# Altium schematic sheet MedusaTester.SchDoc
size Letter
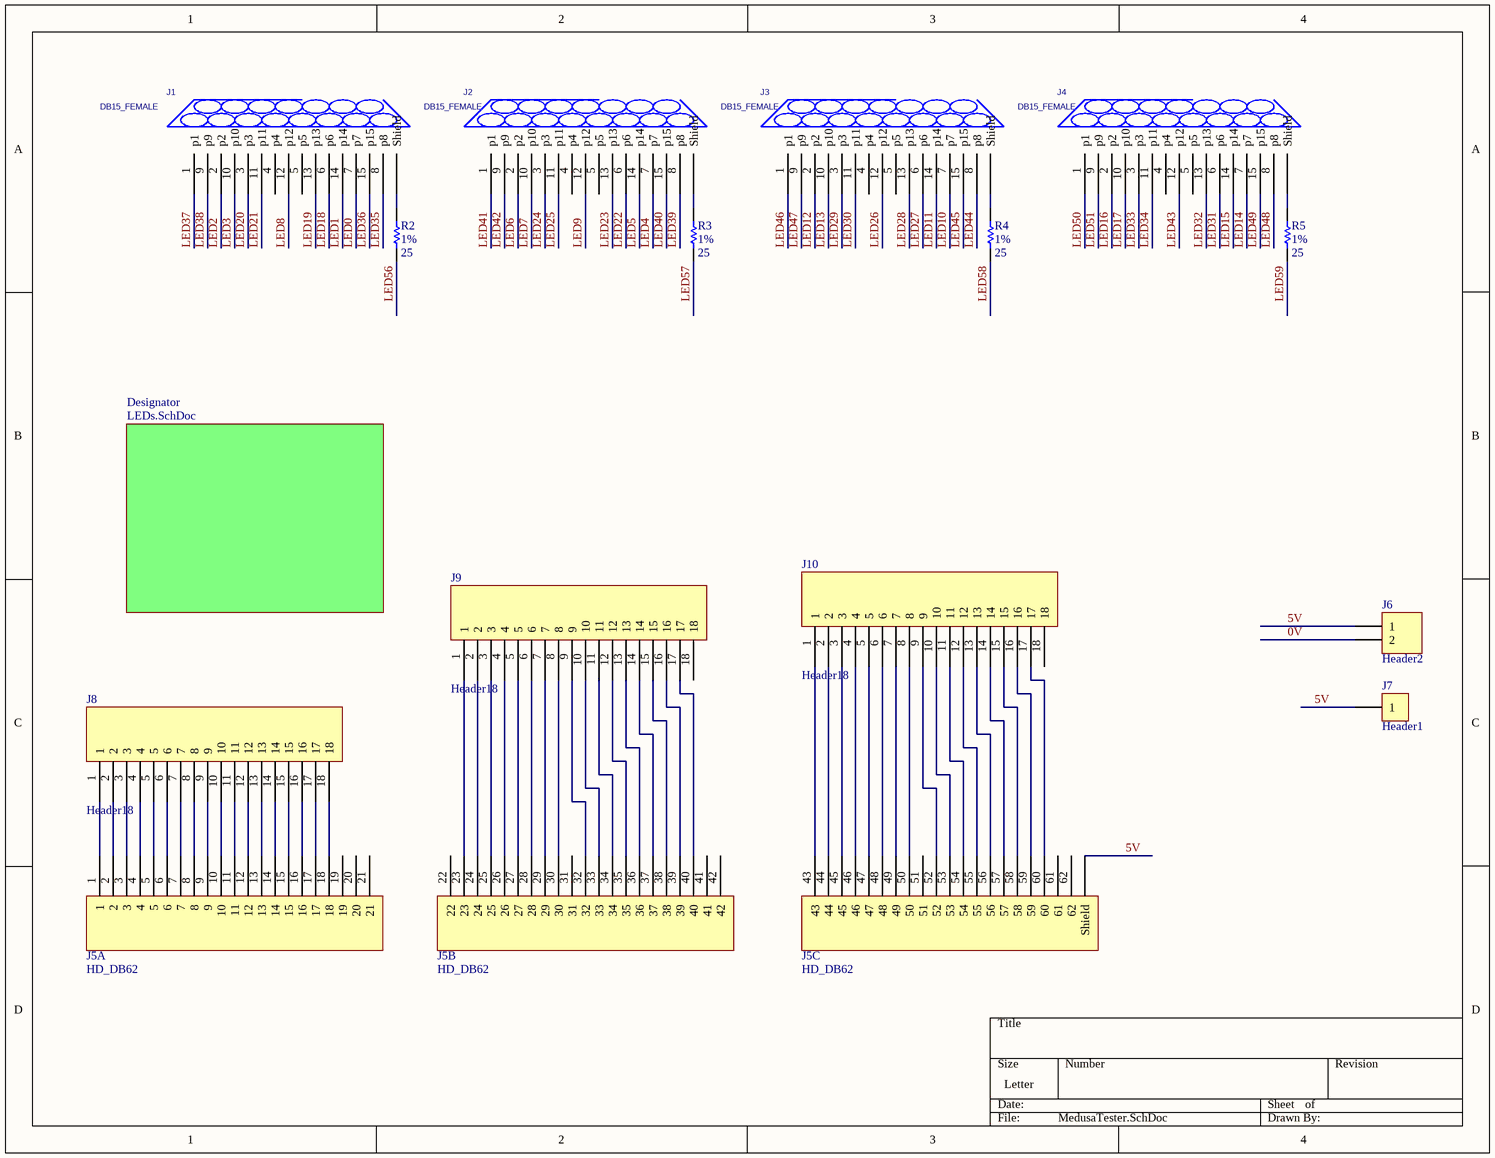
[diagram p0: MedusaTester.SchDoc]

## Parts
J1  DB15_FEMALE  [DSUB/RS.318/TM/15]
J2  DB15_FEMALE  [DSUB/RS.318/TM/15]
J3  DB15_FEMALE  [DSUB/RS.318/TM/15]
J4  DB15_FEMALE  [DSUB/RS.318/TM/15]
J5  HD_DB62  [HD_DB62]  (parts A,B,C of 3)
J6  Header2  [HDR1X2]
J7  Header1  [HDR1]
J8  Header18  [HDR1X18]
J9  Header18  [HDR1X18]
J10  Header18  [HDR1X18]
R2  value 25  Param: 1%  [0603]  (hidden comment: 10k Ohms)
R3  value 25  Param: 1%  [0603]  (hidden comment: 10k Ohms)
R4  value 25  Param: 1%  [0603]  (hidden comment: 10k Ohms)
R5  value 25  Param: 1%  [0603]  (hidden comment: 10k Ohms)

## Sub-sheets
Designator = LEDs.SchDoc: no entries

## Nets
0V: J6.2
5V: J5.HOLE63(Shield) J6.1 J7.1
LED0: J1.7(p7)
LED1: J1.14(p14)
LED2: J1.2(p2)
LED3: J1.10(p10)
LED4: J2.7(p7)
LED5: J2.14(p14)
LED6: J2.2(p2)
LED7: J2.10(p10)
LED8: J1.12(p12)
LED9: J2.12(p12)
LED10: J3.7(p7)
LED11: J3.14(p14)
LED12: J3.2(p2)
LED13: J3.10(p10)
LED14: J4.7(p7)
LED15: J4.14(p14)
LED16: J4.2(p2)
LED17: J4.10(p10)
LED18: J1.6(p6)
LED19: J1.13(p13)
LED20: J1.3(p3)
LED21: J1.11(p11)
LED22: J2.6(p6)
LED23: J2.13(p13)
LED24: J2.3(p3)
LED25: J2.11(p11)
LED26: J3.12(p12)
LED27: J3.6(p6)
LED28: J3.13(p13)
LED29: J3.3(p3)
LED30: J3.11(p11)
LED31: J4.6(p6)
LED32: J4.13(p13)
LED33: J4.3(p3)
LED34: J4.11(p11)
LED35: J1.8(p8)
LED36: J1.15(p15)
LED37: J1.1(p1)
LED38: J1.9(p9)
LED39: J2.8(p8)
LED40: J2.15(p15)
LED41: J2.1(p1)
LED42: J2.9(p9)
LED43: J4.12(p12)
LED44: J3.8(p8)
LED45: J3.15(p15)
LED46: J3.1(p1)
LED47: J3.9(p9)
LED48: J4.8(p8)
LED49: J4.15(p15)
LED50: J4.1(p1)
LED51: J4.9(p9)
LED56: R2.1
LED57: R3.1
LED58: R4.1
LED59: R5.1
NetJ1_Hole30: J1.Hole30(Shield) R2.2
NetJ2_Hole30: J2.Hole30(Shield) R3.2
NetJ3_Hole30: J3.Hole30(Shield) R4.2
NetJ4_Hole30: J4.Hole30(Shield) R5.2
NetJ5_1: J5.1 J8.1
NetJ5_2: J5.2 J8.2
NetJ5_3: J5.3 J8.3
NetJ5_4: J5.4 J8.4
NetJ5_5: J5.5 J8.5
NetJ5_6: J5.6 J8.6
NetJ5_7: J5.7 J8.7
NetJ5_8: J5.8 J8.8
NetJ5_9: J5.9 J8.9
NetJ5_10: J5.10 J8.10
NetJ5_11: J5.11 J8.11
NetJ5_12: J5.12 J8.12
NetJ5_13: J5.13 J8.13
NetJ5_14: J5.14 J8.14
NetJ5_15: J5.15 J8.15
NetJ5_16: J5.16 J8.16
NetJ5_17: J5.17 J8.17
NetJ5_18: J5.18 J8.18
NetJ5_23: J5.23 J9.1
NetJ5_24: J5.24 J9.2
NetJ5_25: J5.25 J9.3
NetJ5_26: J5.26 J9.4
NetJ5_27: J5.27 J9.5
NetJ5_28: J5.28 J9.6
NetJ5_29: J5.29 J9.7
NetJ5_30: J5.30 J9.8
NetJ5_32: J5.32 J9.9
NetJ5_33: J5.33 J9.10
NetJ5_34: J5.34 J9.11
NetJ5_35: J5.35 J9.12
NetJ5_36: J5.36 J9.13
NetJ5_37: J5.37 J9.14
NetJ5_38: J5.38 J9.15
NetJ5_39: J5.39 J9.16
NetJ5_40: J5.40 J9.17
NetJ5_43: J5.43 J10.1
NetJ5_44: J5.44 J10.2
NetJ5_45: J5.45 J10.3
NetJ5_46: J5.46 J10.4
NetJ5_47: J5.47 J10.5
NetJ5_48: J5.48 J10.6
NetJ5_49: J5.49 J10.7
NetJ5_50: J5.50 J10.8
NetJ5_52: J5.52 J10.9
NetJ5_53: J5.53 J10.10
NetJ5_54: J5.54 J10.11
NetJ5_55: J5.55 J10.12
NetJ5_56: J5.56 J10.13
NetJ5_57: J5.57 J10.14
NetJ5_58: J5.58 J10.15
NetJ5_59: J5.59 J10.16
NetJ5_60: J5.60 J10.17

Not connected (* = marked no-connect by the designer): J1 4(p4) 5(p5); J2 4(p4) 5(p5); J3 4(p4) 5(p5); J4 4(p4) 5(p5); J5 19 20 21 22 31 41 42 51 61 62; J9 18; J10 18

## Library data of the parts
J1-J4 = DB15_FEMALE: COMPFIXED: NO; COMPGROUP: 0; COMPHEIGHT: 0.000; COMPLOC: [4502.733,1338.467]; COMPROT: 270; COMPSIDE: TOP; COMPKEY: NO; COMPLOCKED: NO; DECOUPLER: NO; MEMORY: NO
J7 = Header1: TestPoint1; Footprint: *; Techinf: *
R2-R5 = Res0603: Resistor; Param1: 100ppm/C; TechInfo: *
J6 = Header2: Footprint: *; Techinf: *